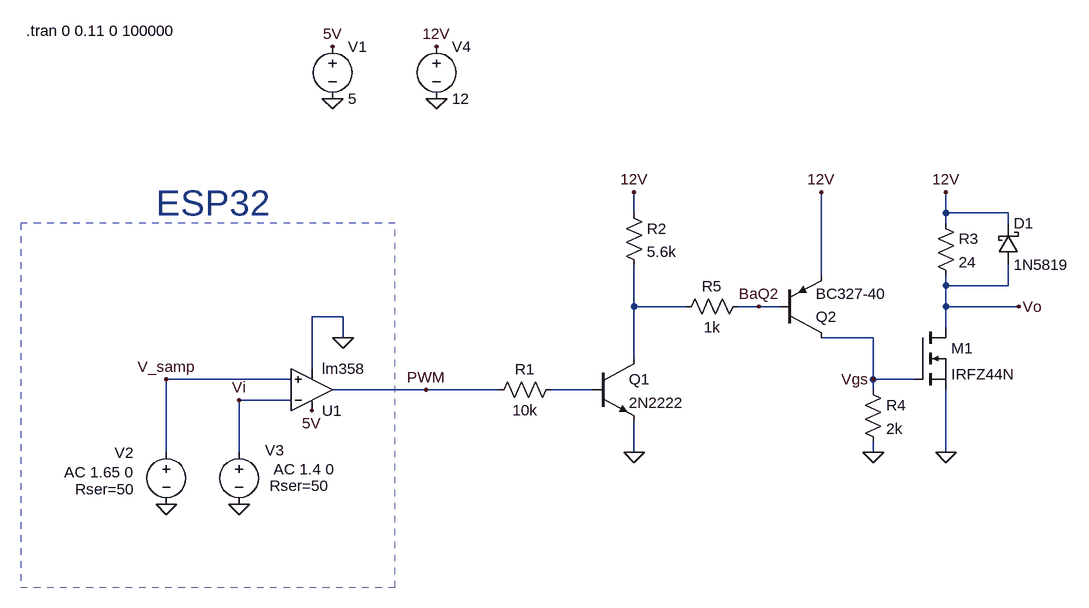
[diagram p0: schematic CircuitDriver_power_V2_PWM_3.asc]
CircuitDriver_power_V2_PWM_3.asc, the LTspice schematic file:
Version 4
SHEET 1 1648 680
WIRE 688 -272 688 -304
WIRE 1168 -272 1168 -304
WIRE 1264 -272 1168 -272
WIRE 1168 -256 1168 -272
WIRE 1264 -256 1264 -272
WIRE 976 -176 976 -304
WIRE 1168 -160 1168 -176
WIRE 1264 -160 1264 -192
WIRE 1264 -160 1168 -160
WIRE 688 -128 688 -192
WIRE 768 -128 688 -128
WIRE 880 -128 848 -128
WIRE 912 -128 880 -128
WIRE 1168 -128 1168 -160
WIRE 1280 -128 1168 -128
WIRE 240 -112 192 -112
WIRE 1168 -96 1168 -128
WIRE 240 -80 240 -112
WIRE 1056 -80 976 -80
WIRE 688 -48 688 -128
WIRE 192 -32 192 -112
WIRE 160 -16 -32 -16
WIRE 1056 -16 1056 -80
WIRE 1120 -16 1056 -16
WIRE 368 0 224 0
WIRE 480 0 368 0
WIRE 624 0 560 0
WIRE 1056 0 1056 -16
WIRE 160 16 80 16
WIRE -32 96 -32 -16
WIRE 80 96 80 16
WIRE 688 96 688 48
WIRE 1056 96 1056 80
WIRE 1168 96 1168 0
FLAG 240 -80 0
FLAG 192 32 5V
FLAG 224 -528 5V
FLAG 224 -448 0
FLAG -32 176 0
FLAG 80 16 Vi
FLAG 688 96 0
FLAG 688 -304 12V
FLAG 80 176 0
FLAG -32 -16 V_samp
FLAG 384 -528 12V
FLAG 384 -448 0
FLAG 368 0 PWM
FLAG 1168 96 0
FLAG 1168 -304 12V
FLAG 1280 -128 Vo
FLAG 1056 -16 Vgs
FLAG 976 -304 12V
FLAG 880 -128 BaQ2
FLAG 1056 96 0
SYMBOL voltage 224 -544 R0
WINDOW 123 0 0 Left 0
WINDOW 39 0 0 Left 0
SYMATTR InstName V1
SYMATTR Value 5
SYMBOL voltage -32 80 M0
WINDOW 0 50 17 Left 2
WINDOW 3 48 104 Invisible 2
WINDOW 123 50 47 Left 2
WINDOW 39 48 73 Left 2
SYMATTR InstName V2
SYMATTR Value PULSE(0 3.3 0.01 0 0.001 0 0.001 100)
SYMATTR Value2 AC 1.65 0
SYMATTR SpiceLine Rser=50
SYMBOL npn 624 -48 R0
SYMATTR InstName Q1
SYMATTR Value 2N2222
SYMBOL res 672 -288 R0
SYMATTR InstName R2
SYMATTR Value 5.6k
SYMBOL voltage 80 80 M0
WINDOW 0 -69 13 Left 2
WINDOW 3 -391 98 Invisible 2
WINDOW 123 -147 42 Left 2
WINDOW 39 -139 68 Left 2
SYMATTR InstName V3
SYMATTR Value PULSE(3.2 0.1 0.01 0.1 0 0 0.1 10)
SYMATTR Value2 AC 1.4 0
SYMATTR SpiceLine Rser=50
SYMBOL res 576 -16 R90
WINDOW 0 0 56 VBottom 2
WINDOW 3 32 56 VTop 2
SYMATTR InstName R1
SYMATTR Value 10k
SYMBOL lm358 192 64 M180
SYMATTR InstName U1
SYMBOL voltage 384 -544 R0
WINDOW 123 0 0 Left 0
WINDOW 39 0 0 Left 0
SYMATTR InstName V4
SYMATTR Value 12
SYMBOL nmos 1120 -96 R0
SYMATTR InstName M1
SYMATTR Value IRFZ44N
SYMBOL res 1152 -272 R0
SYMATTR InstName R3
SYMATTR Value 24
SYMBOL pnp 912 -80 M180
SYMATTR InstName Q2
SYMATTR Value BC327-40
SYMBOL res 864 -144 R90
WINDOW 0 0 56 VBottom 2
WINDOW 3 32 56 VTop 2
SYMATTR InstName R5
SYMATTR Value 1k
SYMBOL res 1040 -16 R0
SYMATTR InstName R4
SYMATTR Value 2k
SYMBOL schottky 1248 -192 M180
WINDOW 0 24 64 Left 2
WINDOW 3 24 0 Left 2
SYMATTR InstName D1
SYMATTR Value 1N5819
SYMATTR Description Diode
SYMATTR Type diode
TEXT -248 -552 Left 2 !.tran 0 0.11 0 100000
TEXT -48 -288 Left 5 ;ESP32
LINE Normal 320 304 320 -256 1
LINE Normal -256 304 320 304 1
LINE Normal -256 -256 -256 304 1
LINE Normal 320 -256 -256 -256 1

The netlist it stands for:
* CircuitDriver_power_V2_PWM_3.asc
V1 5V 0 5
V2 V_samp 0 PULSE(0 3.3 0.01 0 0.001 0 0.001 100) AC 1.65 0 Rser=50
Q1 N001 N002 0 0 2N2222
R2 12V N001 5.6k
V3 Vi 0 PULSE(3.2 0.1 0.01 0.1 0 0 0.1 10) AC 1.4 0 Rser=50
R1 N002 PWM 10k
* U1: lm358 (symbol lm358 not available, pins judged from their places): In+=V_samp In-=Vi V+=5V V-=0 OUT=PWM
V4 12V 0 12
M1 Vo Vgs 0 0 IRFZ44N
R3 12V Vo 24
Q2 Vgs BaQ2 12V 0 BC327-40
R5 BaQ2 N001 1k
R4 Vgs 0 2k
D1 Vo 12V 1N5819
.model D D
.lib standard.dio
.model NPN NPN
.model PNP PNP
.lib standard.bjt
.model NMOS NMOS
.model PMOS PMOS
.lib standard.mos
.tran 0 0.11 0 100000
* ESP32
.backanno
.end